# Altium schematic sheet Sheet_Sensor.SchDoc: RGB Color Sensor - Sensor
size 100 x 100 mm; DrawnBy: Group 2; SheetNumber: 2; SheetTotal: 2
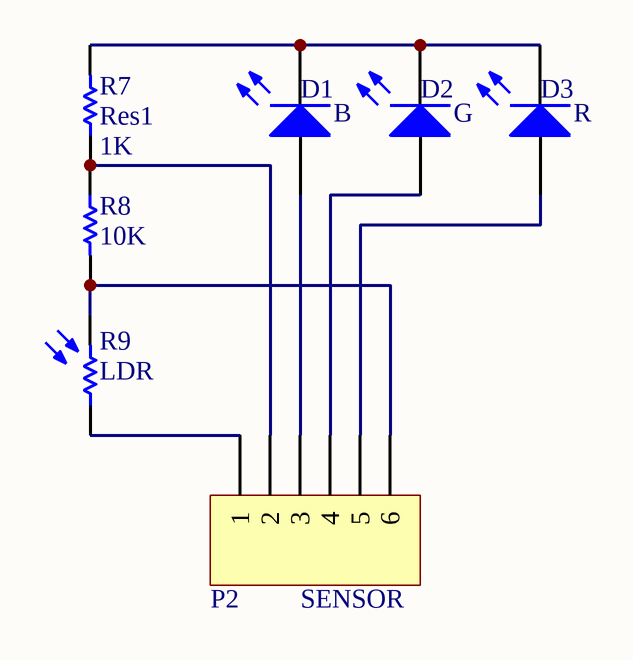
[diagram p0: Sheet_Sensor.SchDoc]

## Parts
D1  B  [LED]
D2  G  [LED]
D3  R  [LED]
P2  SENSOR  [H6]
R7  Res1  value 1K  [RES]
R8  10K  [RES]
R9  LDR  [LDR]

## Nets
NetD1_1: D1.1(A) P2.3
NetD1_2: D1.2(K) D2.2(K) D3.2(K) R7.2
NetD2_1: D2.1(A) P2.4
NetD3_1: D3.1(A) P2.5
NetP2_1: P2.1 R9.1
NetP2_2: P2.2 R7.1 R8.1
NetP2_6: P2.6 R8.2 R9.2

## Library data of the parts
D1-D3 = LED1: Typical RED GaAs LED; Published: 8-Jun-2000; LatestRevisionDate: 08-Jul-2005; LatestRevisionNote: Mech Layer 1 removed.; PackageReference: LED-1; Publisher: Altium Limited; PackageDescription: LED; 2 Leads
P2 = Header 6: Header, 6-Pin; LatestRevisionDate: 17-Jul-2002; LatestRevisionNote: Re-released for DXP Platform.; Publisher: Altium Limited
R7 R8 = Res1: Resistor; Published: 8-Jun-2000; LatestRevisionDate: 17-Jul-2002; LatestRevisionNote: Re-released for DXP Platform.; PackageReference: AXIAL-0.3; Publisher: Altium Limited; PackageDescription: Axial Device, Thru-Hole; 2 Leads; 0.3 in Pin Spacing
  R8: Value: 10K
R9 = LDR: Photoconductive Resistor, 200 kOhm, 100 V, 80 mW, -40 to 75 degC, 2-Pin THD, RoHS; Manufacturer: Excelitas Technology; SVHC: Cadmiumchloride(15-Jun-2015); Power Rating: 80mW; Resistance @ Lux: 12kohm; Voltage Rating: 100V; Product Range: -; Datasheet Version: 09/2006; Resistor Case Style: -; Operating Temperature Max: 75°C; Package Reference: VT90N1; Datasheet URL: http://datasheet.octopart.com/VT90N1-Excelitas-datasheet-10388451.pdf; Mounting Technology: ThroughHole; Operating Temperature Min: -40°C; Dark Resistance: 200kohm; Package Description: 2-Pin Through Hole Device, Body Width 4.17 mm (Max), Height 2.29 mm; Manufacturer URL: http://www.excelitas.com/Pages/Index.aspx; Packaging: Each